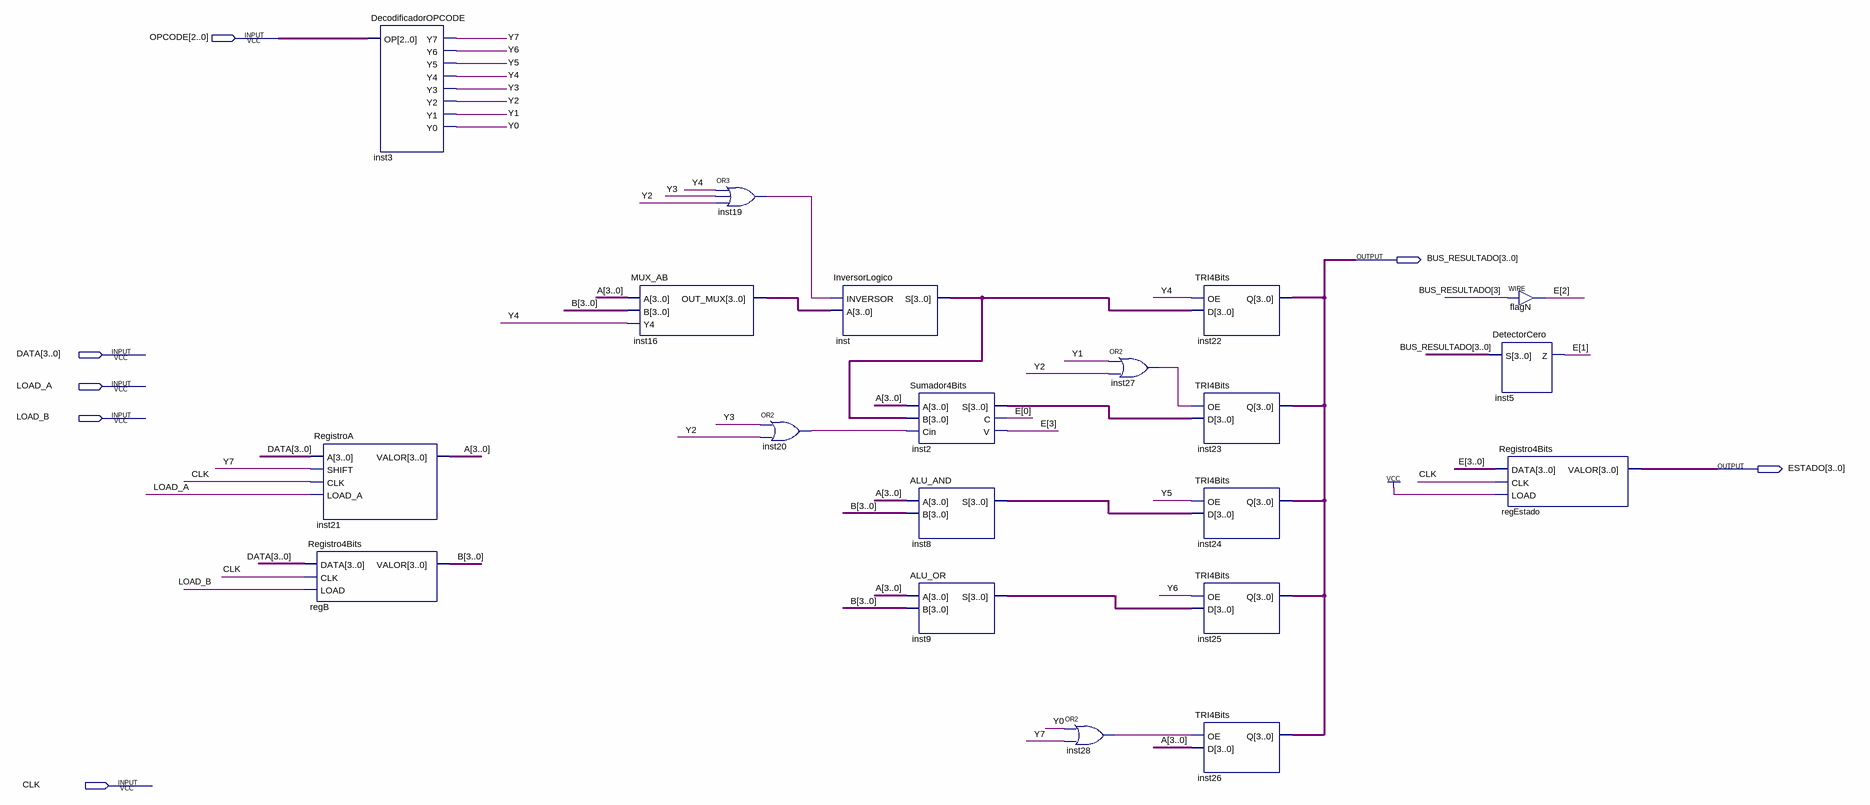
[diagram p0: schematic sheet]
// Quartus schematic Main.bdf as structural Verilog: 20 symbols, 7 pins
module Main (
  input  [2:0] OPCODE,
  input  [3:0] DATA,
  input  LOAD_A,
  input  LOAD_B,
  input  CLK,
  output [3:0] BUS_RESULTADO,
  output [3:0] ESTADO
);

  wire inst19_out, inst20_out, inst27_out, inst28_out, Y0, Y1, Y2, Y3, Y4, Y5, Y6, Y7;
  wire [3:0] A, B, E, inst2_s, inst8_s, inst9_s, inst16_out_mux, inst_s;

  RegistroA inst21 (.A(DATA), .SHIFT(Y7), .CLK(CLK), .LOAD_A(LOAD_A), .VALOR(A));
  Registro4Bits regB (.DATA(DATA), .CLK(CLK), .LOAD(LOAD_B), .VALOR(B));
  DecodificadorOPCODE inst3 (.OP(OPCODE), .Y7(Y7), .Y6(Y6), .Y5(Y5), .Y4(Y4), .Y3(Y3), .Y2(Y2), .Y1(Y1), .Y0(Y0));
  MUX_AB inst16 (.A(A), .B(B), .Y4(Y4), .OUT_MUX(inst16_out_mux));
  or inst19 (inst19_out, Y4, Y3, Y2);
  or inst20 (inst20_out, Y3, Y2);
  InversorLogico inst (.INVERSOR(inst19_out), .A(inst16_out_mux), .S(inst_s));
  Sumador4Bits inst2 (.A(A), .B(inst_s), .Cin(inst20_out), .S(inst2_s), .C(E[0]), .V(E[3]));
  ALU_AND inst8 (.A(A), .B(B), .S(inst8_s));
  ALU_OR inst9 (.A(A), .B(B), .S(inst9_s));
  or inst27 (inst27_out, Y1, Y2);
  or inst28 (inst28_out, Y0, Y7);
  TRI4Bits inst22 (.OE(Y4), .D(inst_s), .Q(BUS_RESULTADO));
  TRI4Bits inst23 (.OE(inst27_out), .D(inst2_s), .Q(BUS_RESULTADO));
  TRI4Bits inst24 (.OE(Y5), .D(inst8_s), .Q(BUS_RESULTADO));
  TRI4Bits inst25 (.OE(Y6), .D(inst9_s), .Q(BUS_RESULTADO));
  TRI4Bits inst26 (.OE(inst28_out), .D(A), .Q(BUS_RESULTADO));
  assign E[2] = BUS_RESULTADO[3];  // WIRE flagN
  DetectorCero inst5 (.S(BUS_RESULTADO), .Z(E[1]));
  Registro4Bits regEstado (.DATA(E), .CLK(CLK), .LOAD(1'b1), .VALOR(ESTADO));
endmodule
